# Altium schematic sheet AVR_MAIN.SchDoc
size A4
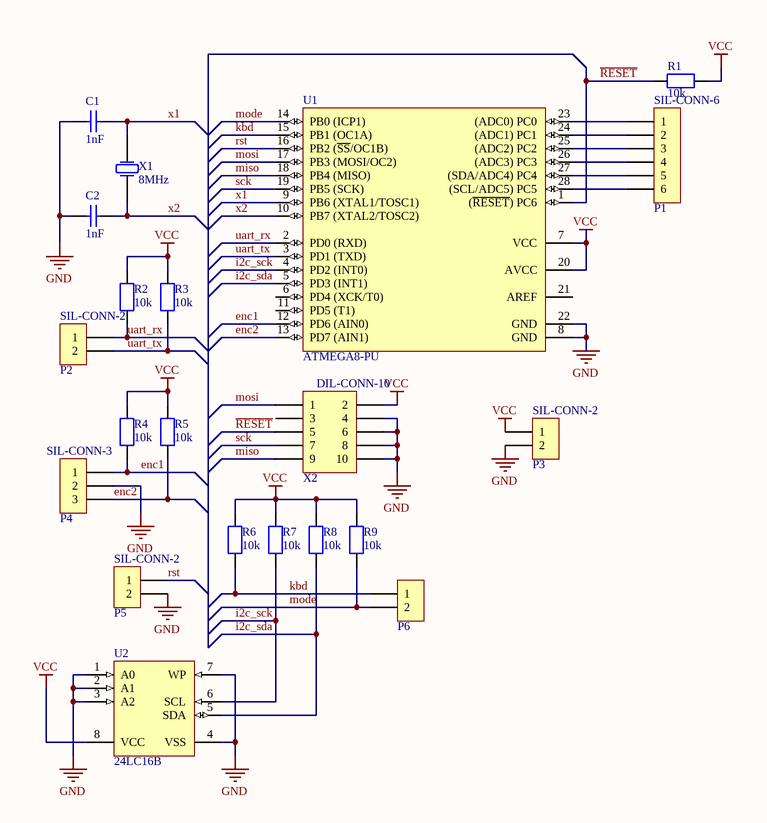
[diagram p0: AVR_MAIN.SchDoc]

## Parts
C1  value 1nF  [0805_Capacitor]  (hidden comment: Capacitor)
C2  value 1nF  [0805_Capacitor]  (hidden comment: Capacitor)
P1  SIL-CONN-6  [SIL-CONN-6]
P2  SIL-CONN-2  [SIL-CONN-2]
P3  SIL-CONN-2  [SIL-CONN-2]
P4  SIL-CONN-3  [SIL-CONN-3]
P5  SIL-CONN-2  [SIL-CONN-2-jumper]
P6  SIL-CONN-2  [SIL-CONN-2]  (value not drawn)
R1  value 10k  [0805_Resistor]  (hidden comment: Resistor)
R2  value 10k  [0805_Resistor]  (hidden comment: Resistor)
R3  value 10k  [0805_Resistor]  (hidden comment: Resistor)
R4  value 10k  [0805_Resistor]  (hidden comment: Resistor)
R5  value 10k  [0805_Resistor]  (hidden comment: Resistor)
R6  value 10k  [0805_Resistor]  (hidden comment: Resistor)
R7  value 10k  [0805_Resistor]  (hidden comment: Resistor)
R8  value 10k  [0805_Resistor]  (hidden comment: Resistor)
R9  value 10k  [0805_Resistor]  (hidden comment: Resistor)
U1  ATMEGA8-PU  [DIP28_Narrow]
U2  24LC16B  [DIP8]
X1  Frequency: 8MHz  [HC49]  (hidden comment: Crystal)
X2  DIL-CONN-10  [DIL-CONN-IDC-10]

## Nets
GND: C1.1 C2.1 P3.2 P4.2 P5.2 U1.8(GND) U1.22(GND) U2.1(A0) U2.2(A1) U2.3(A2) U2.4(VSS) U2.7(WP) X2.4 X2.6 X2.8 X2.10
VCC: P3.1 R1.2 R2.2 R3.2 R4.2 R5.2 R6.2 R7.2 R8.2 R9.2 U1.7(VCC) U1.20(AVCC) U2.8(VCC) X2.2
enc1: P4.1 R4.1 U1.12(PD6_(AIN0))
enc2: P4.3 R5.1 U1.13(PD7_(AIN1))
i2c_sck: R7.1 U1.4(PD2_(INT0)) U2.6(SCL)
i2c_sda: R8.1 U1.5(PD3_(INT1)) U2.5(SDA)
kbd: P6.1 R6.1 U1.15(PB1_(OC1A))
miso: U1.18(PB4_(MISO)) X2.9
mode: P6.2 R9.1 U1.14(PB0_(ICP1))
mosi: U1.17(PB3_(MOSI/OC2)) X2.1
~{RESET}: R1.1 U1.1((~{RESET})_PC6) X2.5
rst: P5.1 U1.16(PB2_(~{SS}/OC1B))
sck: U1.19(PB5_(SCK)) X2.7
uart_rx: P2.1 R2.1 U1.2(PD0_(RXD))
uart_tx: P2.2 R3.1 U1.3(PD1_(TXD))
x1: C1.2 U1.9(PB6_(XTAL1/TOSC1)) X1.2
x2: C2.2 U1.10(PB7_(XTAL2/TOSC2)) X1.1
NetP1_1: P1.1 U1.23((ADC0)_PC0)
NetP1_2: P1.2 U1.24((ADC1)_PC1)
NetP1_3: P1.3 U1.25((ADC2)_PC2)
NetP1_4: P1.4 U1.26((ADC3)_PC3)
NetP1_5: P1.5 U1.27((SDA/ADC4)_PC4)
NetP1_6: P1.6 U1.28((SCL/ADC5)_PC5)

Not connected (* = marked no-connect by the designer): U1 6(PD4_(XCK/T0)) 11(PD5_(T1)) 21(AREF); X2 3